# EAGLE design nonregulation-level-shifter-mk-1.0 (EAGLE 6.5.0)
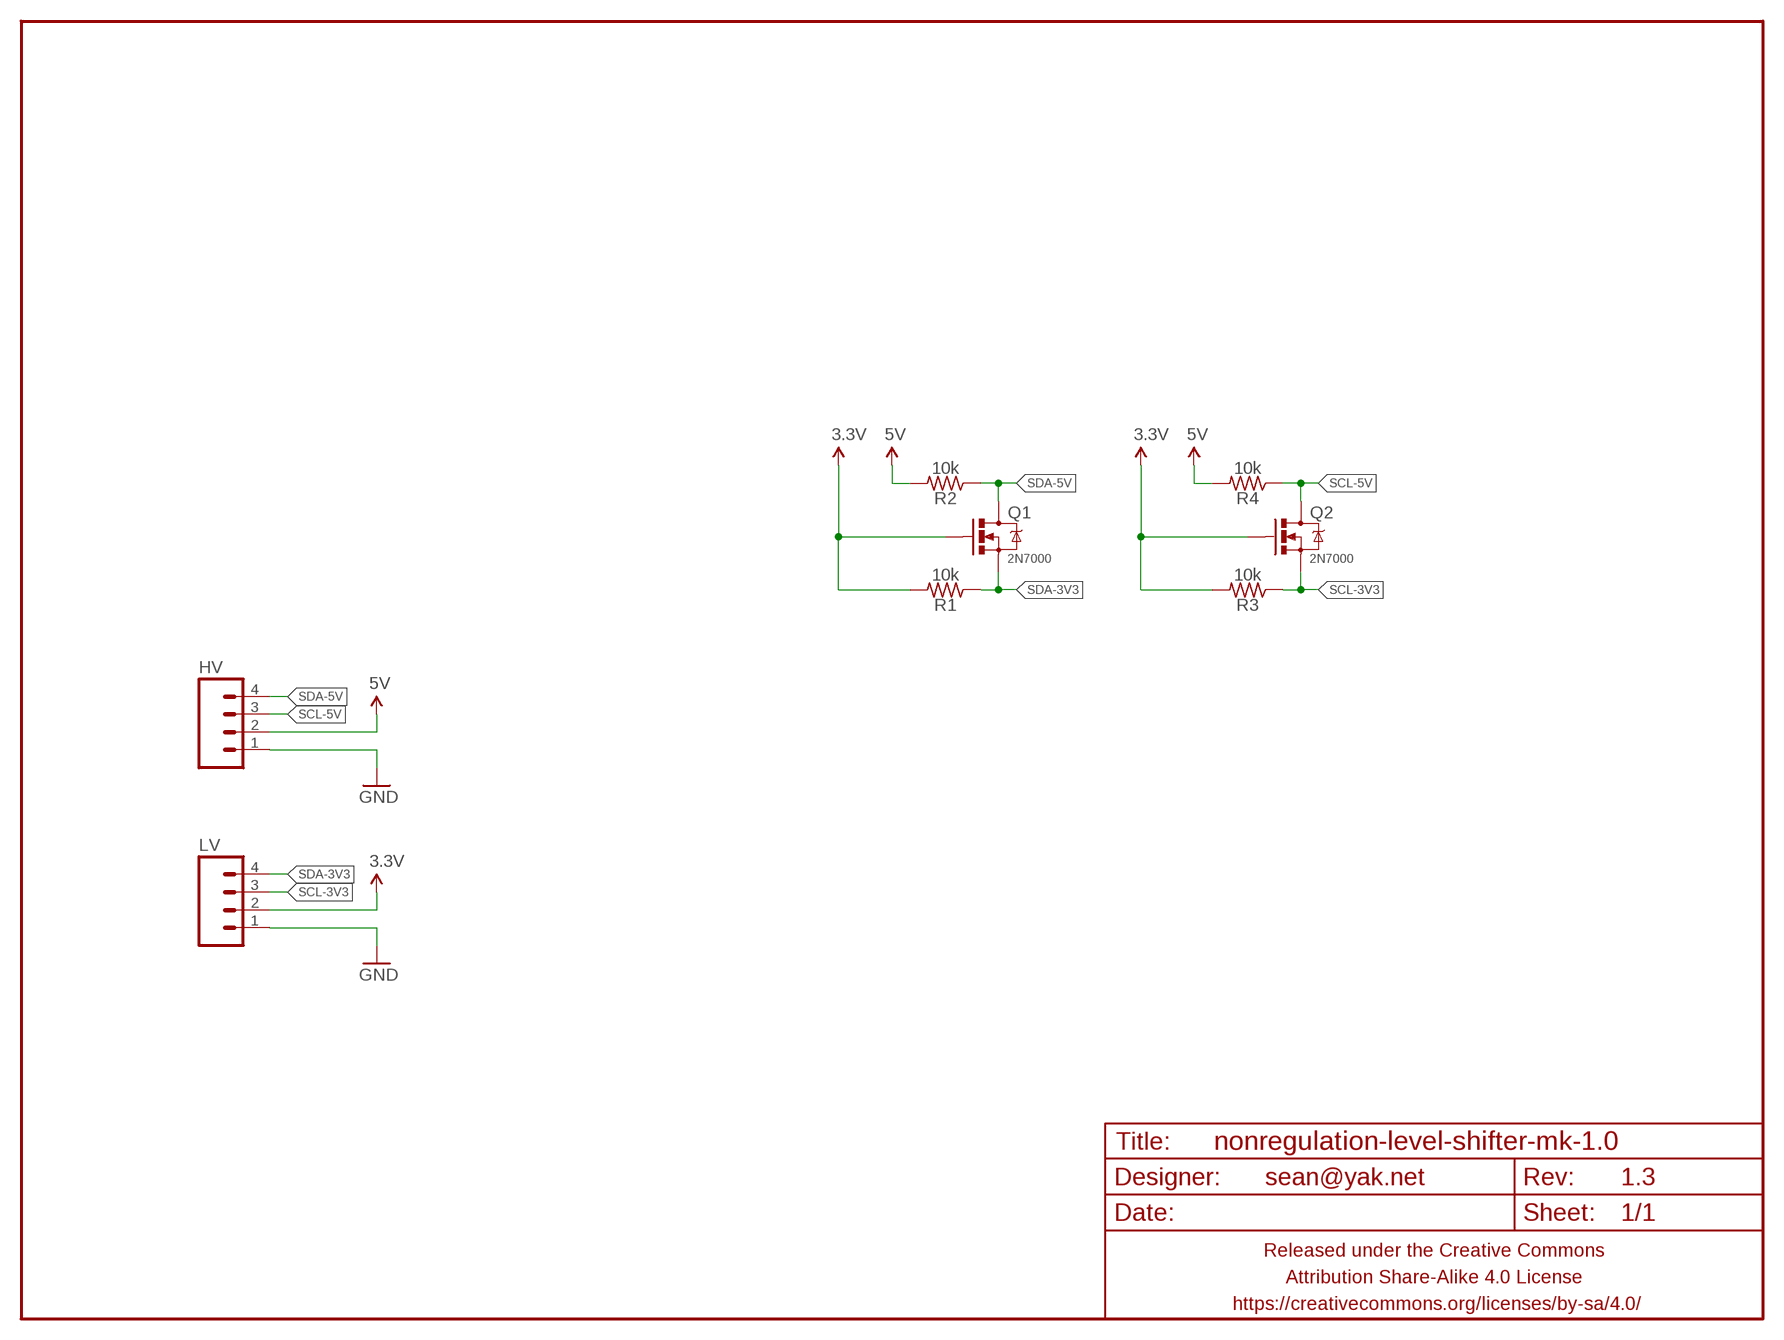
[diagram p0: schematic, sheet 1]

## Parts
FRAME1  FRAME-LETTERNO_PACKAGE  [DUMMY]
HV  M04PTH  [1X04-PTH-VERT]
LV  M04PTH  [1X04-PTH-VERT]
Q1  2N7000  MOSFET-NCHANNEL2N7000-AMMO  [TO-92-AMMO]
Q2  2N7000  MOSFET-NCHANNEL2N7000-AMMO  [TO-92-AMMO]
R1  10k  RESISTORPTH-AXIAL-5.08MM  [RESISTOR-AXIAL-PTH-5.08MM]
R2  10k  RESISTORPTH-AXIAL-5.08MM  [RESISTOR-AXIAL-PTH-5.08MM]
R3  10k  RESISTORPTH-AXIAL-5.08MM  [RESISTOR-AXIAL-PTH-5.08MM]
R4  10k  RESISTORPTH-AXIAL-5.08MM  [RESISTOR-AXIAL-PTH-5.08MM]

## Nets
3.3V: LV.2 Q1.2(G) Q2.2(G) R1.P$2 R3.P$2
5V: HV.2 R2.P$2 R4.P$2
GND: HV.1 LV.1
SCL-3V3: LV.3 Q2.1(S) R3.P$1
SCL-5V: HV.3 Q2.3(D) R4.P$1
SDA-3V3: LV.4 Q1.1(S) R1.P$1
SDA-5V: HV.4 Q1.3(D) R2.P$1

## Library data of the parts
FRAME1 = A_butts:FRAME-LETTER: Schematic Frame Standard 8.5x11 US Letter frame; DESIGNER: sean@yak.net; VERSION: 1.3
HV LV = A_butts:M04: Header 4 Standard 4-pin 0.1" header. Use with straight break away headers (SKU : PRT-00116), right angle break away headers (PRT-00553), swiss pins (PRT-00743), machine pins (PRT-00117), and female headers (PRT-00115). Molex polarized connector foot print use with SKU : PRT-08231 with associated crimp pins and housings. 1MM SMD Version SKU: PRT-10208
Q1 Q2 = A_butts:MOSFET-NCHANNEL: Common NMOSFET Parts MFG P/N Store ID Prod ID FDD8780 TRANS-09984 SI7820DN TRANS-11055 FDS6630A IC-08089 2N7002PW TRANS-11151 FQP30N06L COM-10213 TRANS-10060 BSS123LT1G TRANS-08345 BSS138 TRANS-00830 BS170 2N7000
R1-R4 = A_butts:RESISTOR: RESISTOR, American symbol

## Board
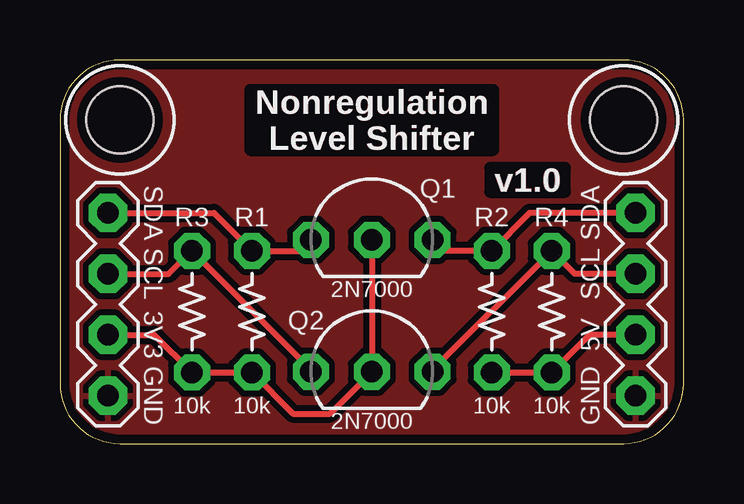
[diagram p1: board, top side]
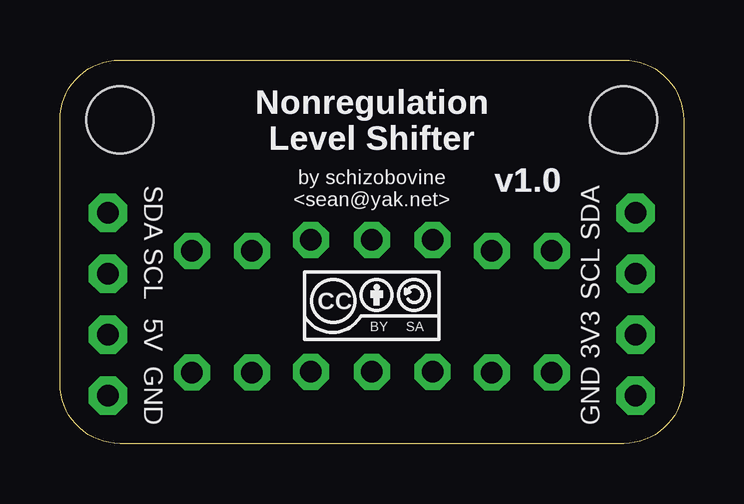
[diagram p2: board, bottom side, seen from below]

Size 26 x 16 mm. Coordinates in mm from the lower left corner, seen from the top.
Outline: 2.5,0 23.5,0 arc90 26,2.5 26,13.5 arc90 23.5,16 2.5,16 arc90 0,13.5 0,2.5 arc90 2.5,0
Copper layers (1*16): Top 0.0356mm / dielectric 1.5011mm / Bottom 0.0356mm
Design rules "LaenPCBOrder_2": minimum track width 6mil, minimum drill 13mil, track to track 6mil, track to pad 6mil, pad to pad 6mil, via to via 6mil, smd to smd 6mil, copper to edge 15mil, drill to drill 6mil, minimum pad ring 7mil, minimum via ring 7mil, stop-mask expansion 3mil, vias tented up to drill 20mil, thermal gap 10mil
Holes 2.8 mm at 2.5,13.5 23.5,13.5

### Footprints (pad centres in the part's own frame; a part is rotated, then mirrored left to right if it is on the bottom)
1X04-PTH-VERT = drill 0.9 pad 1.6 octagon: 1 0,0; 2 2.54,0; 3 5.08,0; 4 7.62,0
TO-92-AMMO = drill 0.9 pad 1.5 octagon: 1 -2.54,0; 2 0,0; 3 2.54,0
RESISTOR-AXIAL-PTH-5.08MM = drill 0.9 pad 1.5 octagon: P$1 -2.54,0; P$2 2.54,0

### Placement (x,y rotation side)
FRAME1  0,0 0 top
HV  24,2 90 top
LV  2,2 90 top
Q1  13,8.5 0 top
Q2  13,3 0 top
R1  8,5.5 270 top
R2  18,5.5 270 top
R3  5.5,5.5 270 top
R4  20.5,5.5 270 top
U$1  [CC-BY-SA-4.0-NO-URL]  13,5.75 0 bottom

### Tracks (layer width: path | path; a pad name or v marks a point on that pad's centre or on a via)
3.3V
  Top 0.25: Q1.2 Q2.2 11.25,1.25 9.71,1.25 R1.P$2 R3.P$2 3.92,4.54 LV.2
5V
  Top 0.25: HV.2 22.08,4.54 R4.P$2 R2.P$2
GND
  pour Top (isolate 0.25): 26,0 0,0 0,16 26,16
SCL-3V3
  Top 0.25: LV.3 4.54,7.08 R3.P$1 10.46,3.08 Q2.1
SCL-5V
  Top 0.25: HV.3 21.46,7.08 R4.P$1 15.54,3.08 Q2.3
SDA-3V3
  Top 0.25: LV.4 6.42,9.62 R1.P$1 10,8.04 Q1.1
SDA-5V
  Top 0.25: Q1.3 16,8.04 R2.P$1 19.58,9.62 HV.4

### Text on the board
Top: Nonregulation / Level Shifter
Bottom: Nonregulation / Level Shifter
tPlace: Nonregulation / Level Shifter
bPlace: Nonregulation / Level Shifter | by schizobovine / <sean@yak.net>
tNames: SDA | SDA | SCL | SCL | 3V3 | 5V | GND | GND
bNames: SDA | SDA | SCL | SCL | 3V3 | 5V | GND | GND